# EAGLE design DMX_dimmer (EAGLE 6.5.0)
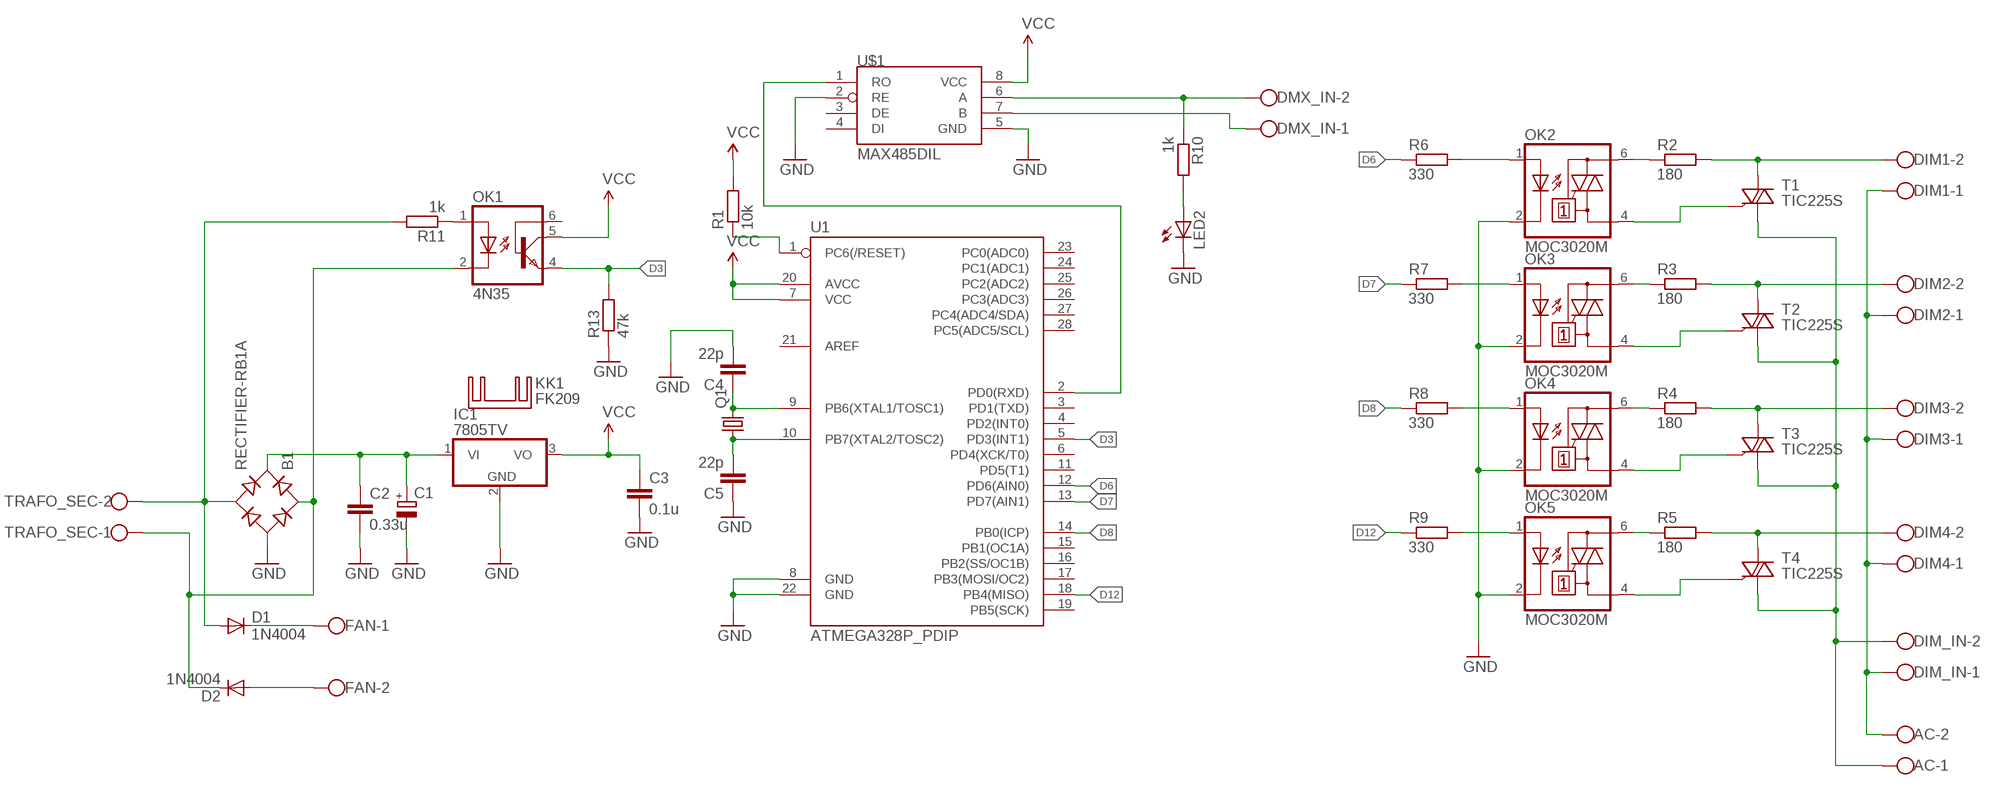
[diagram p0: schematic, sheet 1]

## Parts
AC  W237-102  [W237-102]
B1  RECTIFIER-RB1A  [RB1A]
C1  CPOL-EUE5-10.5  [E5-10,5]
C2  0.33u  C-EU050-024X044  [C050-024X044]
C3  0.1u  C-EU050-024X044  [C050-024X044]
C4  22p  C-EU025-024X044  [C025-024X044]
C5  22p  C-EU025-024X044  [C025-024X044]
D1  1N4004  [DO41-10]
D2  1N4004  [DO41-10]
DIM1  W237-102  [W237-102]
DIM2  W237-102  [W237-102]
DIM3  W237-102  [W237-102]
DIM4  W237-102  [W237-102]
DIM_IN  W237-102  [W237-102]
DMX_IN  W237-102  [W237-102]
FAN  W237-102  [W237-102]
IC1  7805TV  [TO220V]
KK1  FK209  [FK209]
LED2  LED3MM  [LED3MM]
OK1  4N35  [DIL06]
OK2  MOC3020M  [DIL06]
OK3  MOC3020M  [DIL06]
OK4  MOC3020M  [DIL06]
OK5  MOC3020M  [DIL06]
Q1  CRYSTALHC49U-V  [HC49U-V]
R1  10k  R-EU_0207/7  [0207/7]
R2  180  R-EU_0207/2V  [0207/2V]
R3  180  R-EU_0207/2V  [0207/2V]
R4  180  R-EU_0207/2V  [0207/2V]
R5  180  R-EU_0207/2V  [0207/2V]
R6  330  R-EU_0207/7  [0207/7]
R7  330  R-EU_0207/7  [0207/7]
R8  330  R-EU_0207/7  [0207/7]
R9  330  R-EU_0207/7  [0207/7]
R10  1k  R-EU_0207/7  [0207/7]
R11  1k  R-EU_0207/7  [0207/7]
R13  47k  R-EU_0207/7  [0207/7]
T1  TIC225S  [TO220DS]
T2  TIC225S  [TO220DS]
T3  TIC225S  [TO220DS]
T4  TIC225S  [TO220DS]
TRAFO_SEC  W237-102  [W237-102]
U1  ATMEGA328P_PDIP  [DIL28-3]
U$1  MAX485DIL  [DIL08]

## Nets
D3: OK1.4(EMI) R13.2 U1.5(PD3(INT1))
D6: R6.1 U1.12(PD6(AIN0))
D7: R7.1 U1.13(PD7(AIN1))
D8: R8.1 U1.14(PB0(ICP))
D12: R9.1 U1.18(PB4(MISO))
DIM_IN-1: AC.2 DIM1.1 DIM2.1 DIM3.1 DIM4.1 DIM_IN.1
DIM_IN-2: AC.1 DIM_IN.2 T1.A1 T2.A1 T3.A1 T4.A1
GND: B1.- C1.- C2.2 C3.2 C4.2 C5.1 IC1.2(GND) LED2.K(C) OK2.2(C) OK3.2(C) OK4.2(C) OK5.2(C) R13.1 U1.8(GND) U1.22(GND) U$1.2(RE) U$1.5(GND)
N$1: DIM1.2 R2.2 T1.A2
N$2: OK2.6(A2) R2.1
N$3: DIM2.2 R3.2 T2.A2
N$4: OK4.1(A) R8.2
N$5: OK3.6(A2) R3.1
N$6: OK3.1(A) R7.2
N$7: DIM4.2 R5.2 T4.A2
N$8: OK2.1(A) R6.2
N$9: OK4.6(A2) R4.1
N$10: OK5.6(A2) R5.1
N$11: OK5.4(A1) T4.G
N$12: OK4.4(A1) T3.G
N$13: OK3.4(A1) T2.G
N$14: C5.2 Q1.1 U1.10(PB7(XTAL2/TOSC2))
N$15: C4.1 Q1.2 U1.9(PB6(XTAL1/TOSC1))
N$16: OK2.4(A1) T1.G
N$17: DIM3.2 R4.2 T3.A2
N$18: D1.C FAN.1
N$19: D2.A FAN.2
N$20: U1.2(PD0(RXD)) U$1.1(RO)
N$21: OK5.1(A) R9.2
N$22: LED2.A R10.2
N$23: DMX_IN.2 R10.1 U$1.6(A)
N$24: DMX_IN.1 U$1.7(B)
N$26: OK1.1(A) R11.1
N$27: R1.1 U1.1(PC6(/RESET))
N$30: B1.AC1 D2.C OK1.2(C) TRAFO_SEC.1
N$31: B1.+ C1.+ C2.1 IC1.1(VI)
N$33: B1.AC2 D1.A R11.2 TRAFO_SEC.2
VCC: C3.1 IC1.3(VO) OK1.5(COL) R1.2 U1.7(VCC) U1.20(AVCC) U$1.8(VCC)
Unconnected: OK1.6(BAS) U1.3(PD1(TXD)) U1.4(PD2(INT0)) U1.6(PD4(XCK/T0)) U1.11(PD5(T1)) U1.15(PB1(OC1A)) U1.16(PB2(SS/OC1B)) U1.17(PB3(MOSI/OC2)) U1.19(PB5(SCK)) U1.21(AREF) U1.23(PC0(ADC0)) U1.24(PC1(ADC1)) U1.25(PC2(ADC2)) U1.26(PC3(ADC3)) U1.27(PC4(ADC4/SDA)) U1.28(PC5(ADC5/SCL)) U$1.3(DE) U$1.4(DI)

## Library data of the parts
AC DIM1-DIM4 DIM_IN DMX_IN FAN TRAFO_SEC = con-wago-500:W237-102: WAGO SCREW CLAMP; MPN: 237-102; OC_FARNELL: unknown; OC_NEWARK: 70K9898
B1 = rectifier:RECTIFIER-: Rectifier
C1 = rcl:CPOL-EU: POLARIZED CAPACITOR, European symbol
C2-C5 = rcl:C-EU: CAPACITOR, European symbol
D1 D2 = adafruit:1N4004: DIODE General purpose 1N400x type rectifier (With bigger pads) http://www.ladyada.net/library/pcb/eaglelibrary.html
IC1 = linear:78*: Positive VOLTAGE REGULATOR Source: http://cache.national.com/ds/LM/LM78L05.pdf http://www.fairchildsemi.com/ds/LM/LM7805.pdf
KK1 = heatsink:FK209: HEATSINK manufacturer Fischer/distributor Buerklin
LED2 = led:LED: LED OSRAM: - CHIPLED LG R971, LG N971, LY N971, LG Q971, LY Q971, LO R971, LY R971 LH N974, LH R974 LS Q976, LO Q976, LY Q976 LO Q996 - Hyper CHIPLED LW Q18S LB Q993, LB Q99A, LB R99A - SideLED LS A670, LO A670, LY A670, LG A670, LP A670 LB A673, LV A673, LT A673, LW A673 LH A674 LY A675 LS A676, LA A676, LO A676, LY A676, LW A676 LS A679, LY A679, LG A679 - Hyper Micro SIDELED® LS Y876, LA Y876, LO Y876, LY Y876 LT Y87S - SmartLED LW L88C, LW L88S LB L89C, LB L89S, LG L890 LS L89K, LO L89K, LY L89K LS L896, LA L896, LO L896, LY L896 - TOPLED LS T670, LO T670, LY T670, LG T670, LP T670 LSG T670, LSP T670, LSY T670, LOP T670, LYG T670 LG T671, LOG T671, LSG T671 LB T673, LV T673, LT T673, LW T673 LH T674 LS T676, LA T676, LO T676, LY T676, LB T676, LH T676, LSB T676, LW T676 LB T67C, LV T67C, LT T67C, LS T67K, LO T67K, LY T67K, LW E67C LS E67B, LA E67B, LO E67B, LY E67B, LB E67C, LV E67C, LT E67C LW T67C LS T679, LY T679, LG T679 LS T770, LO T770, LY T770, LG T770, LP T770 LB T773, LV T773, LT T773, LW T773 LH T774 LS E675, LA E675, LY E675, LS T675 LS T776, LA T776, LO T776, LY T776, LB T776 LHGB T686 LT T68C, LB T68C - Hyper Mini TOPLED® LB M676 - Mini TOPLED Santana® LG M470 LS M47K, LO M47K, LY M47K Source: http://www.osram.convergy.de LUXEON: - LUMILED® LXK2-PW12-R00, LXK2-PW12-S00, LXK2-PW14-U00, LXK2-PW14-V00 LXK2-PM12-R00, LXK2-PM12-S00, LXK2-PM14-U00 LXK2-PE12-Q00, LXK2-PE12-R00, LXK2-PE12-S00, LXK2-PE14-T00, LXK2-PE14-U00 LXK2-PB12-K00, LXK2-PB12-L00, LXK2-PB12-M00, LXK2-PB14-N00, LXK2-PB14-P00, LXK2-PB14-Q00 LXK2-PR12-L00, LXK2-PR12-M00, LXK2-PR14-Q00, LXK2-PR14-R00 LXK2-PD12-Q00, LXK2-PD12-R00, LXK2-PD12-S00 LXK2-PH12-R00, LXK2-PH12-S00 LXK2-PL12-P00, LXK2-PL12-Q00, LXK2-PL12-R00 Source: www.luxeon.com KINGBRIGHT: KA-3528ASYC Source: www.kingbright.com
OK1 = optocoupler:4N35: MOTOROLA OPTO COUPLER; MF: FAIRCHILD SEMICONDUCTOR; MPN: 4N35; OC_FARNELL: 1328375; OC_NEWARK: 72K9946
OK2-OK5 = optocoupler:MOC30*M: RANDOM-PHASE OPTOISOLATORS TRIAC DRIVER OUTPUT Source: http://www.fairchildsemi.com MOC3020-M.pdf; MF: FAIRCHILD SEMICONDUCTOR; MPN: MOC3020-M; OC_FARNELL: 1505425; OC_NEWARK: 72K8895
Q1 = crystal:CRYSTAL: CRYSTAL; OC_FARNELL: 1666969; OC_NEWARK: unknown
R1-R11 R13 = rcl:R-EU_: RESISTOR, European symbol
T1-T4 = triac:TIC225S: TRIAC
U1 = SparkFun-DigitalIC:ATMEGA328P_PDIP: uC used in the Arduino 32kb flash, 1k EEPROM, 2k SRAM This is the through-hole version of this chip.
U$1 = SparkFun:MAX485

## Board
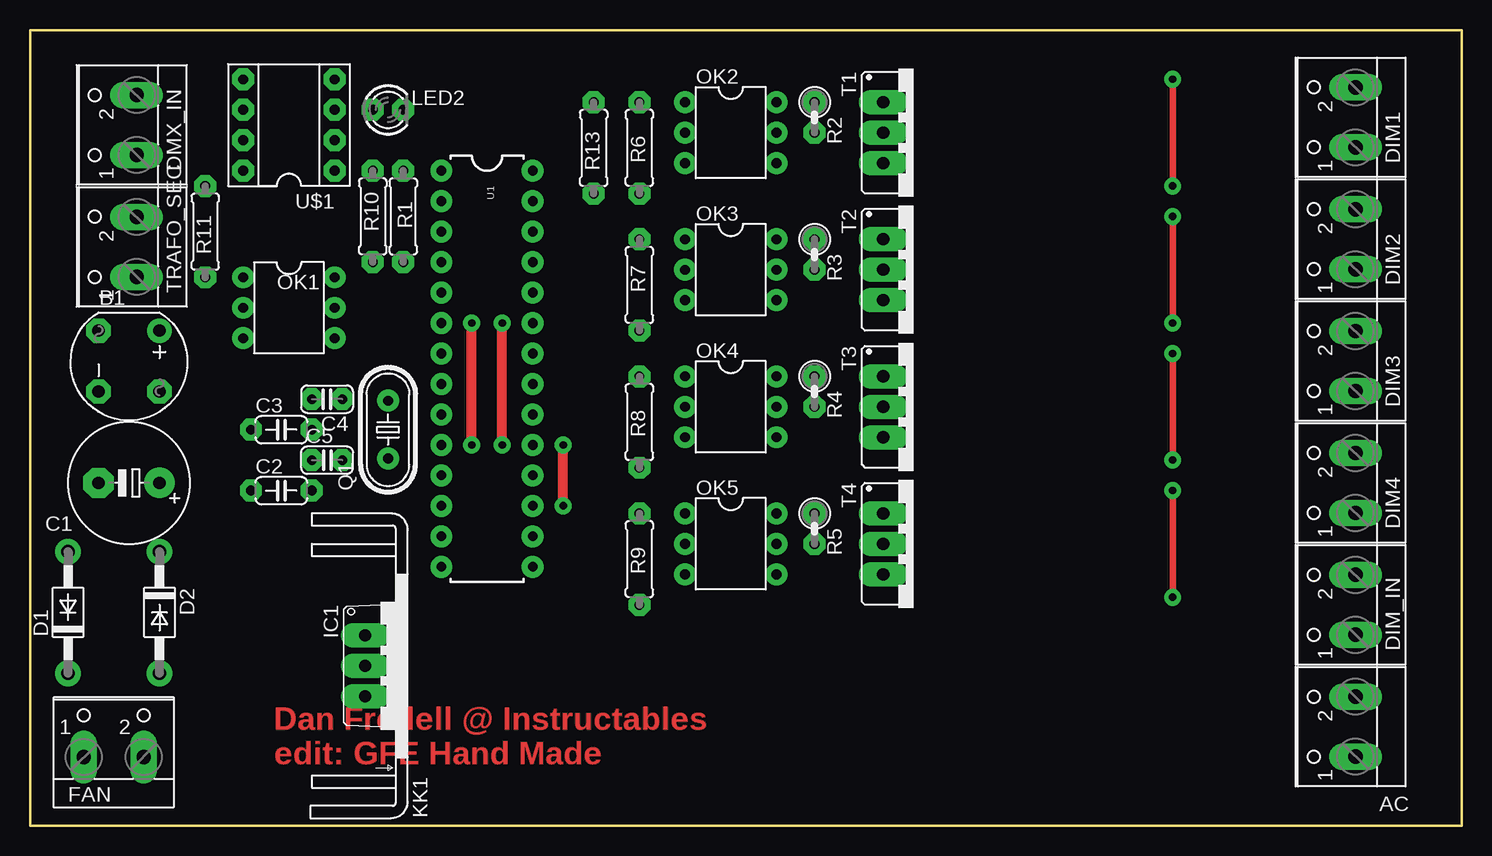
[diagram p1: board, top side]
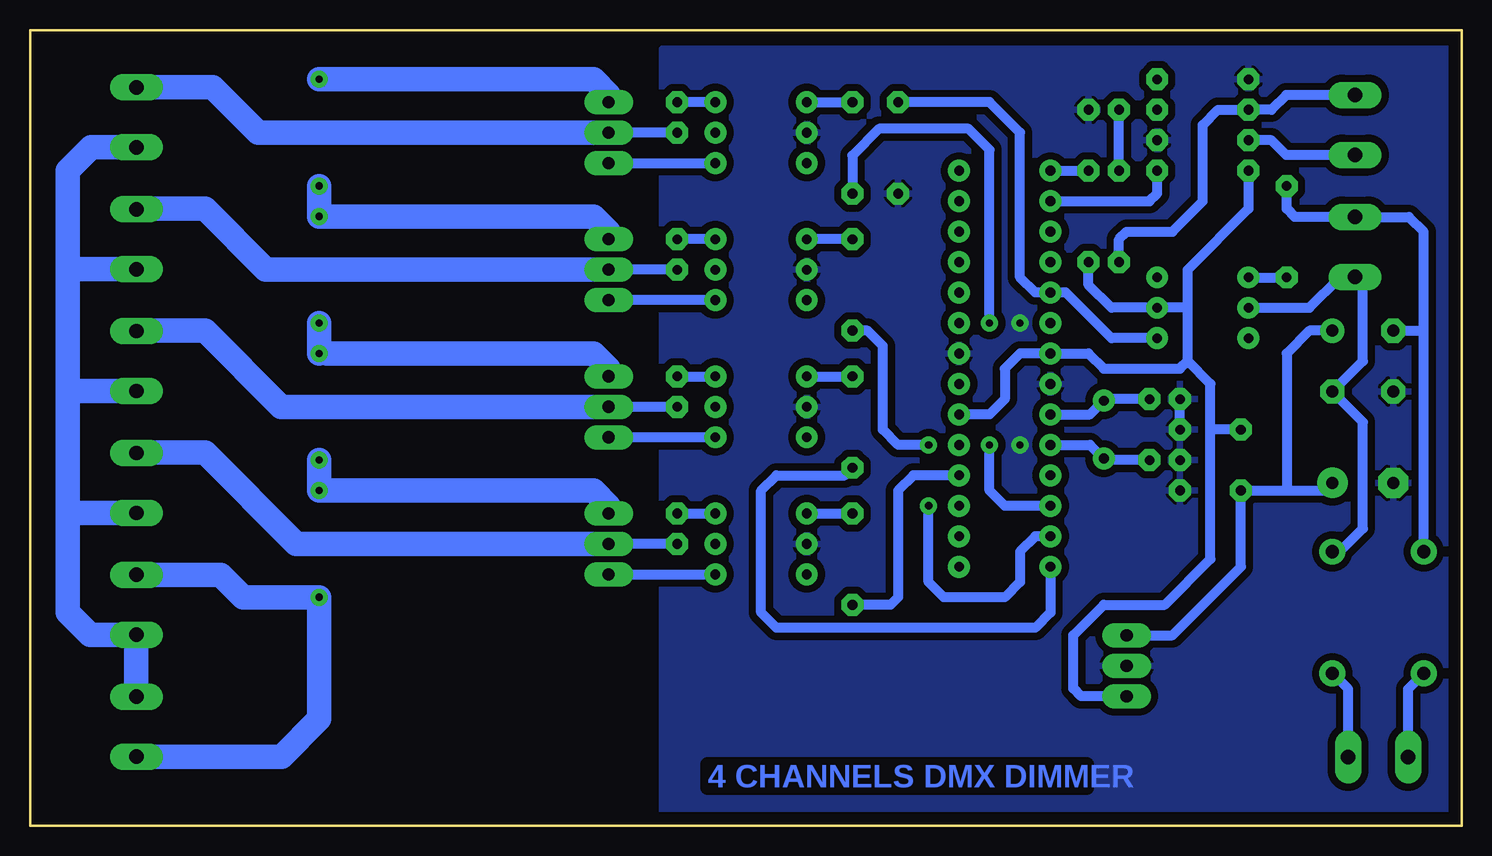
[diagram p2: board, bottom side, seen from below]

Size 119.36 x 66.34 mm. Coordinates in mm from the lower left corner, seen from the top.
Outline: 0,0 119.36,0 119.36,66.34 0,66.34 0,0
Copper layers (1*16): Top 0.035mm / dielectric 1.5mm / Bottom 0.035mm
Design rules "default *": minimum track width 10mil, minimum drill 24mil, track to track 8mil, track to pad 8mil, pad to pad 8mil, via to via 8mil, smd to smd 8mil, copper to edge 40mil, drill to drill 8mil, minimum pad ring 20mil, minimum via ring 16mil, stop-mask expansion 4mil, vias tented up to drill 0mil, thermal gap 10mil

### Footprints (pad centres in the part's own frame; a part is rotated, then mirrored left to right if it is on the bottom)
W237-102 = drill 1.194 long: 1 -2.5,-1.27; 2 2.5,-1.27
RB1A = drill 1.016: + -2.54,2.54 | drill 1.016 octagon: - 2.54,-2.54; AC1 2.54,2.54; AC2 -2.54,-2.54
E5-10,5 = drill 1.016 pad 2.54: + -2.54,0 | drill 1.016 pad 2.54 octagon: - 2.54,0
C050-024X044 = drill 0.813 octagon: 1 -2.54,0; 2 2.54,0
C025-024X044 = drill 0.813 octagon: 1 -1.27,0; 2 1.27,0
DO41-10 = drill 1.118 pad 1.93: A 5.08,0; C -5.08,0
TO220V = drill 1.016 long: 1 -2.54,-2.54; 2 0,-2.54; 3 2.54,-2.54
LED3MM = drill 0.813 octagon: A -1.27,0; K 1.27,0
DIL06 = drill 0.813: 1 -2.54,-3.81; 2 0,-3.81; 3 2.54,-3.81; 4 2.54,3.81; 5 0,3.81; 6 -2.54,3.81
HC49U-V = drill 0.813: 1 -2.413,0; 2 2.413,0
0207/7 = drill 0.813 octagon: 1 -3.81,0; 2 3.81,0
0207/2V = drill 0.813 octagon: 1 -1.27,0; 2 1.27,0
TO220DS = drill 1.016 long: A1 -2.54,-2.54; A2 0,-2.54; G 2.54,-2.54
DIL28-3 = drill 0.813: 1 -16.51,-3.81; 2 -13.97,-3.81; 3 -11.43,-3.81; 4 -8.89,-3.81; 5 -6.35,-3.81; 6 -3.81,-3.81; 7 -1.27,-3.81; 8 1.27,-3.81; 9 3.81,-3.81; 10 6.35,-3.81; 11 8.89,-3.81; 12 11.43,-3.81; 13 13.97,-3.81; 14 16.51,-3.81; 15 16.51,3.81; 16 13.97,3.81; 17 11.43,3.81; 18 8.89,3.81; 19 6.35,3.81; 20 3.81,3.81; 21 1.27,3.81; 22 -1.27,3.81; 23 -3.81,3.81; 24 -6.35,3.81; 25 -8.89,3.81; 26 -11.43,3.81; 27 -13.97,3.81; 28 -16.51,3.81
DIL08 = drill 0.813 pad 1.6 octagon: 1 -3.81,-3.81; 2 -1.27,-3.81; 3 1.27,-3.81; 4 3.81,-3.81; 5 3.81,3.81; 6 1.27,3.81; 7 -1.27,3.81; 8 -3.81,3.81

### Placement (x,y rotation side)
AC  109.22,8.26 90 top
B1  8.26,38.73 270 top
C1  8.26,28.57 180 top
C2  20.95,27.94 0 top
C3  20.95,33.02 0 top
C4  24.77,35.56 180 top
C5  24.77,30.48 0 top
D1  3.17,17.78 90 top
D2  10.79,17.78 270 top
DIM1  109.22,59.05 90 top
DIM2  109.22,48.9 90 top
DIM3  109.22,38.73 90 top
DIM4  109.22,28.57 90 top
DIM_IN  109.22,18.41 90 top
DMX_IN  7.62,58.42 90 top
FAN  6.98,6.99 0 top
IC1  30.48,13.34 270 top
KK1  30.48,13.34 90 top
LED2  29.84,59.69 0 top
OK1  21.59,43.18 270 top
OK2  58.42,57.78 270 top
OK3  58.42,46.35 270 top
OK4  58.42,34.92 270 top
OK5  58.42,23.5 270 top
Q1  29.84,33.02 90 top
R1  31.11,50.8 270 top
R2  65.41,59.05 270 top
R3  65.41,47.62 270 top
R4  65.41,36.2 270 top
R5  65.41,24.77 270 top
R6  50.8,56.52 90 top
R7  50.8,45.09 90 top
R8  50.8,33.66 90 top
R9  50.8,22.23 90 top
R10  28.57,50.8 90 top
R11  14.61,49.53 90 top
R13  46.99,56.52 90 top
T1  73.66,57.78 270 top
T2  73.66,46.35 270 top
T3  73.66,34.92 270 top
T4  73.66,23.5 270 top
TRAFO_SEC  7.62,48.26 90 top
U1  38.1,38.1 270 top
U$1  21.59,58.42 90 top
U$2  [LOGO-GRANDE]  80.01,6.35 0 top

### Tracks (layer width: path | path; a pad name or v marks a point on that pad's centre or on a via)
D3
  Bottom 0.813: OK1.4 29.21,40.64 33.02,44.45 U1.5 35.56,44.45 36.83,45.72 36.83,57.78 39.37,60.33 R13.2
D6  (via drill 0.6)
  Top 0.813: v39.37,31.75 v39.37,41.91
  Bottom 0.813: U1.12 38.1,26.67 39.37,27.94 v39.37,31.75 | v39.37,41.91 39.37,56.36 41.12,58.1 48.58,58.1 50.8,55.88 R6.1
D7  (via drill 0.6)
  Top 0.813: v44.45,26.67 v44.45,31.75
  Bottom 0.813: U1.13 35.56,24.13 36.83,22.86 36.83,20.32 38.1,19.05 43.18,19.05 44.45,20.32 v44.45,26.67 | v44.45,31.75 46.99,31.75 48.26,33.02 48.26,40.01 49.53,41.27 R7.1
D8
  Bottom 0.813: U1.14 34.29,17.78 35.56,16.51 57.15,16.51 58.42,17.78 58.42,27.94 57.15,29.21 51.44,29.21 R8.1
D12
  Bottom 0.813: U1.18 45.72,29.21 46.99,27.94 46.99,19.05 47.62,18.41 R9.1
DIM_IN-1
  Bottom 0.813: 116.16,46.4 116.2,46.35 | 116.16,36.23 116.2,36.2 | 116.16,26.07 116.2,26.04
  Bottom 2.032: DIM1.1 114.26,56.55 116.2,54.61 116.2,46.35 116.2,36.2 116.2,26.04 116.2,17.78 114.34,15.91 DIM_IN.1 AC.2 | DIM2.1 116.16,46.4 | DIM3.1 116.16,36.23 | DIM4.1 116.16,26.07
DIM_IN-2  (via drill 0.6)
  Top 0.559: v95.25,30.48 v95.25,39.37 | v95.25,41.91 v95.25,50.8 | v95.25,62.23 v95.25,53.34 | v95.25,27.94 v95.25,19.05
  Bottom 0.406: 110.49,20.95 DIM_IN.2
  Bottom 2.032: DIM_IN.2 103.46,20.91 101.6,19.05 v95.25,19.05 95.25,8.89 98.38,5.75 AC.1 | v95.25,30.48 v95.25,27.94 72.39,27.94 71.12,26.67 T4.A1 | v95.25,39.37 95.25,40.01 | 95.25,40.01 v95.25,41.91 | v95.25,53.34 v95.25,50.8 72.39,50.8 71.12,49.53 T2.A1 | T1.A1 71.12,60.96 72.39,62.23 v95.25,62.23 | T3.A1 71.12,38.1 72.39,39.37 94.61,39.37 95.25,40.01
GND  (via drill 0.6)
  Top 0.813: v36.83,31.75 v36.83,41.91
  Bottom 0.813: C3.2 C4.2
  pour Bottom (isolate 0.61): -1.9,0 66.67,0 66.67,64.77 -1.9,64.77
N$1
  Bottom 0.813: R2.2 72.39,57.78
  Bottom 1.676: 110.45,61.59 DIM1.2
  Bottom 2.032: T1.A2 72.39,57.78 100.33,57.78 104.14,61.59 110.45,61.59
N$2
  Bottom 0.813: OK2.6 R2.1
N$3
  Bottom 0.813: R3.2 T2.A2
  Bottom 2.032: T2.A2 99.69,46.35 104.77,51.44 110.45,51.44 DIM2.2
N$4
  Bottom 0.813: OK4.1 R8.2
N$5
  Bottom 0.813: OK3.6 R3.1
N$6
  Bottom 0.813: R7.2 OK3.1
N$7
  Bottom 0.813: R5.2 T4.A2
  Bottom 2.032: T4.A2 97.16,23.5 104.77,31.11 110.45,31.11 DIM4.2
N$8
  Bottom 0.813: OK2.1 R6.2
N$9
  Bottom 0.813: R4.1 OK4.6
N$10
  Bottom 0.813: R5.1 OK5.6
N$11
  Bottom 0.813: T4.G OK5.4
N$12
  Bottom 0.813: OK4.4 T3.G
N$13
  Bottom 0.813: OK3.4 T2.G
N$14
  Bottom 0.813: C5.2 29.72,30.48 Q1.1 30.99,31.75 U1.10
N$15
  Bottom 0.813: U1.9 30.99,34.29 Q1.2 29.72,35.56 C4.1
N$16
  Bottom 0.813: T1.G OK2.4
N$17
  Bottom 0.813: R4.2 71.75,34.92
  Bottom 2.032: T3.A2 71.75,34.92 98.42,34.92 104.77,41.27 110.45,41.27 DIM3.2
N$18
  Bottom 0.813: FAN.1 4.48,11.39 D1.C
N$19
  Bottom 0.813: FAN.2 9.48,11.39 D2.A
N$20
  Bottom 0.813: U1.2 26.04,52.07 25.4,52.7 U$1.1
N$21
  Bottom 0.813: OK5.1 R9.2
N$22
  Bottom 0.813: R10.2 LED2.A
N$23
  Bottom 0.813: DMX_IN.2 14.64,60.92 15.88,59.69 U$1.6 20.32,59.69 21.59,58.42 21.59,52.07 24.13,49.53 27.94,49.53 28.57,48.9 R10.1
N$24
  Bottom 0.813: DMX_IN.1 14.64,55.92 15.88,57.15 U$1.7
N$26
  Bottom 0.813: OK1.1 R11.1
N$27
  Bottom 0.813: U1.1 R1.1
N$30
  Bottom 0.813: D2.C 10.16,22.86 8.26,24.77 8.26,33.66 B1.AC1 8.26,38.73 8.26,45.12 TRAFO_SEC.1 8.93,45.72 10.16,45.72 12.7,43.18 OK1.2
N$31
  Bottom 0.813: IC1.1 24.13,15.88 18.41,21.59 C2.1 14.61,27.94 | 14.61,27.94 11.43,27.94 C1.+ | B1.+ 12.7,41.27 14.61,39.37 14.61,27.94
N$33
  Bottom 0.813: R11.2 14.61,51.44 13.93,50.76 TRAFO_SEC.2 4.4,50.76 3.17,49.53 3.17,41.27 | D1.A 3.17,41.27 | B1.AC2 3.17,41.27
VCC
  Bottom 0.813: U1.20 39.37,34.29 38.1,35.56 38.1,38.1 36.83,39.37 U1.7 31.11,39.37 29.84,38.1 23.5,38.1 22.86,38.73 | R1.2 31.11,45.09 29.21,43.18 OK1.5 22.86,43.18 | 22.86,38.73 22.86,43.18 | 22.86,43.18 22.86,46.35 17.78,51.44 U$1.8 | IC1.3 31.75,10.79 32.38,11.43 32.38,15.88 29.84,18.41 24.77,18.41 20.95,22.23 20.95,33.02 | 20.95,33.02 20.95,36.83 22.86,38.73 | C3.1 20.95,33.02

### Text on the board
Top: Dan Fredell @ Instructables / edit: GFE Hand Made
Bottom: 4 CHANNELS DMX DIMMER